# Altium project LIDO_HW_2022_04_V01.PrjPcb (part 3 of 3)

## Sheet LIDO-HW.300.DisplayInterface.SchDoc
size A3; SheetNumber: 15; SheetTotal: 17
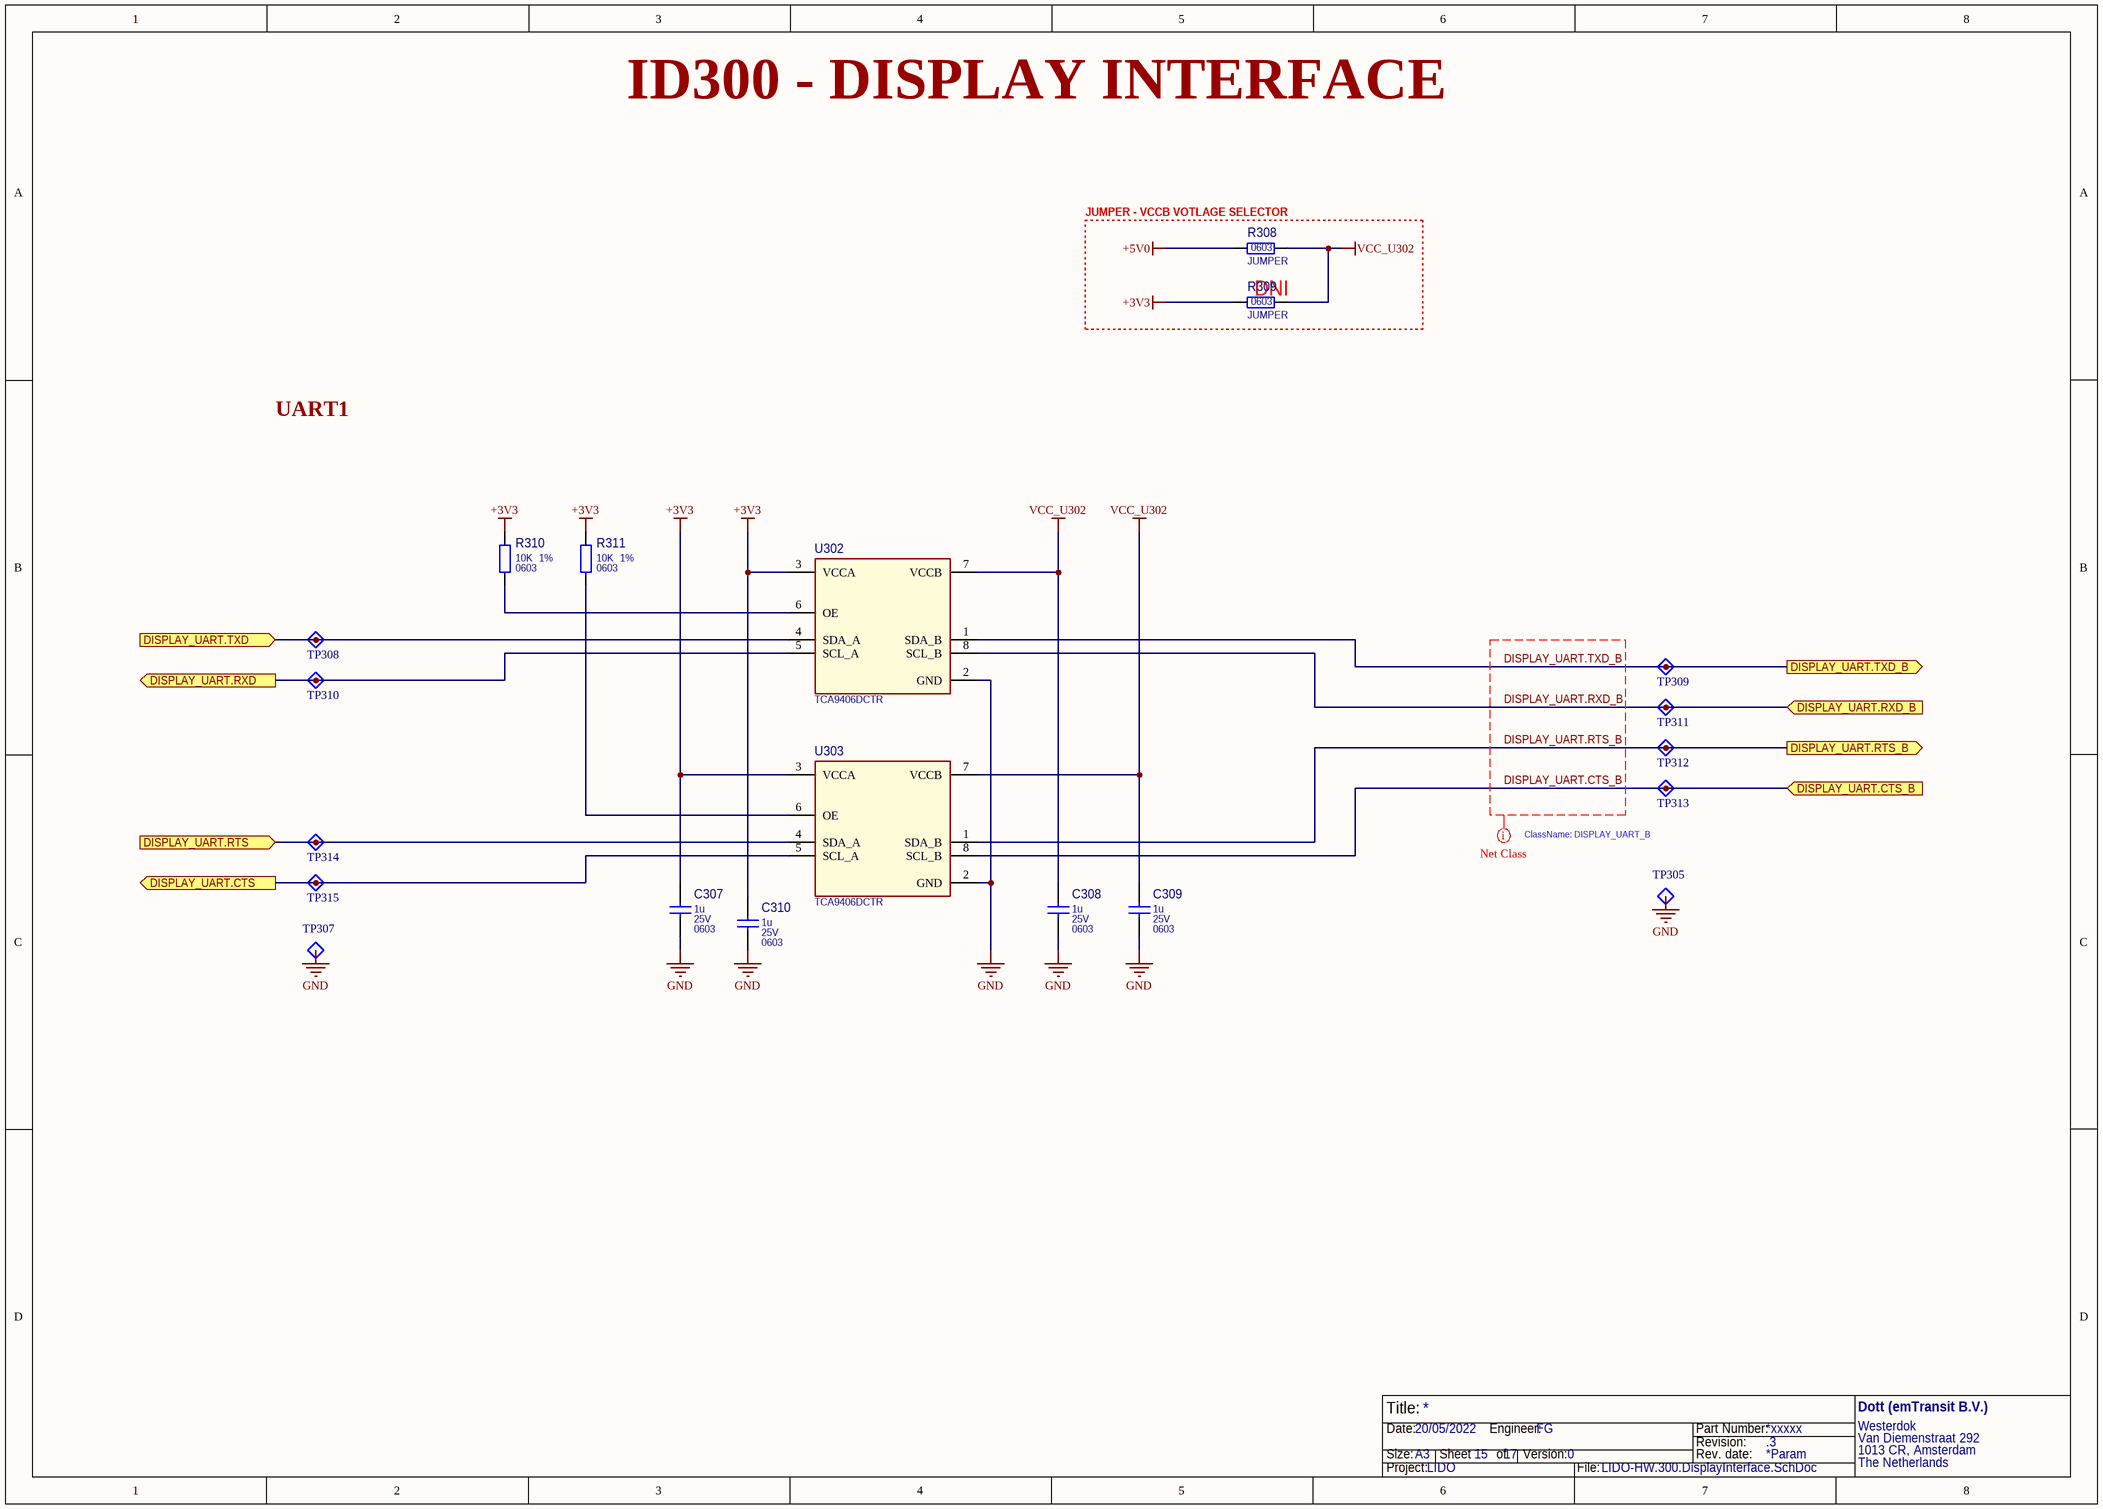
[diagram p14: LIDO-HW.300.DisplayInterface.SchDoc]

### Parts
C307  1u  Part Value 2: 25V  Part Package: 0603  [CAP_0603_1608X90-N_MURATA_A]
C308  1u  Part Value 2: 25V  Part Package: 0603  [CAP_0603_1608X90-N_MURATA_A]
C309  1u  Part Value 2: 25V  Part Package: 0603  [CAP_0603_1608X90-N_MURATA_A]
C310  1u  Part Value 2: 25V  Part Package: 0603  [CAP_0603_1608X90-N_MURATA_A]
R308  JUMPER  Part Package: 0603  [RES_0603_1608X60-N_YAGEO_A]
R309  JUMPER  Part Package: 0603  [RES_0603_1608X60-N_YAGEO_A]
R310  10K  Part Value 2: 1%  Part Package: 0603  [RES_0603_1608X60-N_YAGEO_A]
R311  10K  Part Value 2: 1%  Part Package: 0603  [RES_0603_1608X60-N_YAGEO_A]
TP305  TestPoint_A  [TESTPOINT_1D_A]  (value not drawn)  (no BOM)
TP307  TestPoint_A  [TESTPOINT_1D_A]  (value not drawn)  (no BOM)
TP308  TestPoint_A  [TESTPOINT_1D_A]  (value not drawn)  (no BOM)
TP309  TestPoint_A  [TESTPOINT_1D_A]  (value not drawn)  (no BOM)
TP310  TestPoint_A  [TESTPOINT_1D_A]  (value not drawn)  (no BOM)
TP311  TestPoint_A  [TESTPOINT_1D_A]  (value not drawn)  (no BOM)
TP312  TestPoint_A  [TESTPOINT_1D_A]  (value not drawn)  (no BOM)
TP313  TestPoint_A  [TESTPOINT_1D_A]  (value not drawn)  (no BOM)
TP314  TestPoint_A  [TESTPOINT_1D_A]  (value not drawn)  (no BOM)
TP315  TestPoint_A  [TESTPOINT_1D_A]  (value not drawn)  (no BOM)
U302  TCA9406DCTR  [SSOP8P65_295X400X130L40X25-N_TI_A]
U303  TCA9406DCTR  [SSOP8P65_295X400X130L40X25-N_TI_A]

### Blocks framed on the sheet
JUMPER - VCCB VOTLAGE SELECTOR: R308 R309

### Ports
DISPLAY_UART.CTS (out), DISPLAY_UART.CTS_B (in), DISPLAY_UART.RTS (in), DISPLAY_UART.RTS_B (out), DISPLAY_UART.RXD (out), DISPLAY_UART.RXD_B (in), DISPLAY_UART.TXD (in), DISPLAY_UART.TXD_B (out)

### Nets
+3V3: C307.1 C310.1 R309.1 R310.2 R311.2 U302.3(VCCA) U303.3(VCCA)
+5V0: R308.1
GND: C307.2 C308.2 C309.2 C310.2 TP305.1(TP) TP307.1(TP) U302.2(GND) U303.2(GND)
VCC_U302: C308.1 C309.1 R308.2 R309.2 U302.7(VCCB) U303.7(VCCB)
DISPLAY_UART.CTS: TP315.1(TP) U303.5(SCL_A) ; port DISPLAY_UART.CTS
DISPLAY_UART.CTS_B: TP313.1(TP) U303.8(SCL_B) ; port DISPLAY_UART.CTS_B
DISPLAY_UART.RTS: TP314.1(TP) U303.4(SDA_A) ; port DISPLAY_UART.RTS
DISPLAY_UART.RTS_B: TP312.1(TP) U303.1(SDA_B) ; port DISPLAY_UART.RTS_B
DISPLAY_UART.RXD: TP310.1(TP) U302.5(SCL_A) ; port DISPLAY_UART.RXD
DISPLAY_UART.RXD_B: TP311.1(TP) U302.8(SCL_B) ; port DISPLAY_UART.RXD_B
DISPLAY_UART.TXD: TP308.1(TP) U302.4(SDA_A) ; port DISPLAY_UART.TXD
DISPLAY_UART.TXD_B: TP309.1(TP) U302.1(SDA_B) ; port DISPLAY_UART.TXD_B
NetR310_1: R310.1 U302.6(OE)
NetR311_1: R311.1 U303.6(OE)

### Layout directives
net class DISPLAY_UART_B: DISPLAY_UART.CTS_B, DISPLAY_UART.RTS_B, DISPLAY_UART.RXD_B, DISPLAY_UART.TXD_B

### Notes on the sheet
- ID300 - DISPLAY INTERFACE
- UART1
- ClassName: DISPLAY_UART_B
- Title:
- Size:
- Date:
- A3
- Sheet       of
- Engineer:
- Version:
- Part Number:
- Revision:
- Rev. date:
- Project:
- File:

### Library data of the parts
C307-C310 = 78: as C154 on sheet LIDO-HW.100.InputStage_2; Part Value: 1u; Part Value 3: X7R; Package Type: SMT
R308 R309 = 9: as R138 on sheet LIDO-HW.100.InputStage_2; Part Value: JUMPER; Part Value 2: 5%; Part Value 3: 1/10W; Package Type: SMT
R310 R311 = 115: as R132-R134 on sheet LIDO-HW.100.InputStage_2; Part Value: 10K; Part Value 3: 1/10W; Package Type: SMT
TP305 TP307-TP315 = 3: as TP113-TP119 on sheet LIDO-HW.100.InputStage_2; 02_Layer: *; 01_Diameter: 1mm
U302 U303 = 6: as U103 on sheet LIDO-HW.100.InputStage_2; Manufacturer Part Number: TCA9406DCTR; Part Type: Level Translator; Part Value: TCA9406DCTR; Package Type: SMT

## Sheet LIDO-HW.300.StatusLightInterface.SchDoc
size A3; SheetNumber: 16; SheetTotal: 17
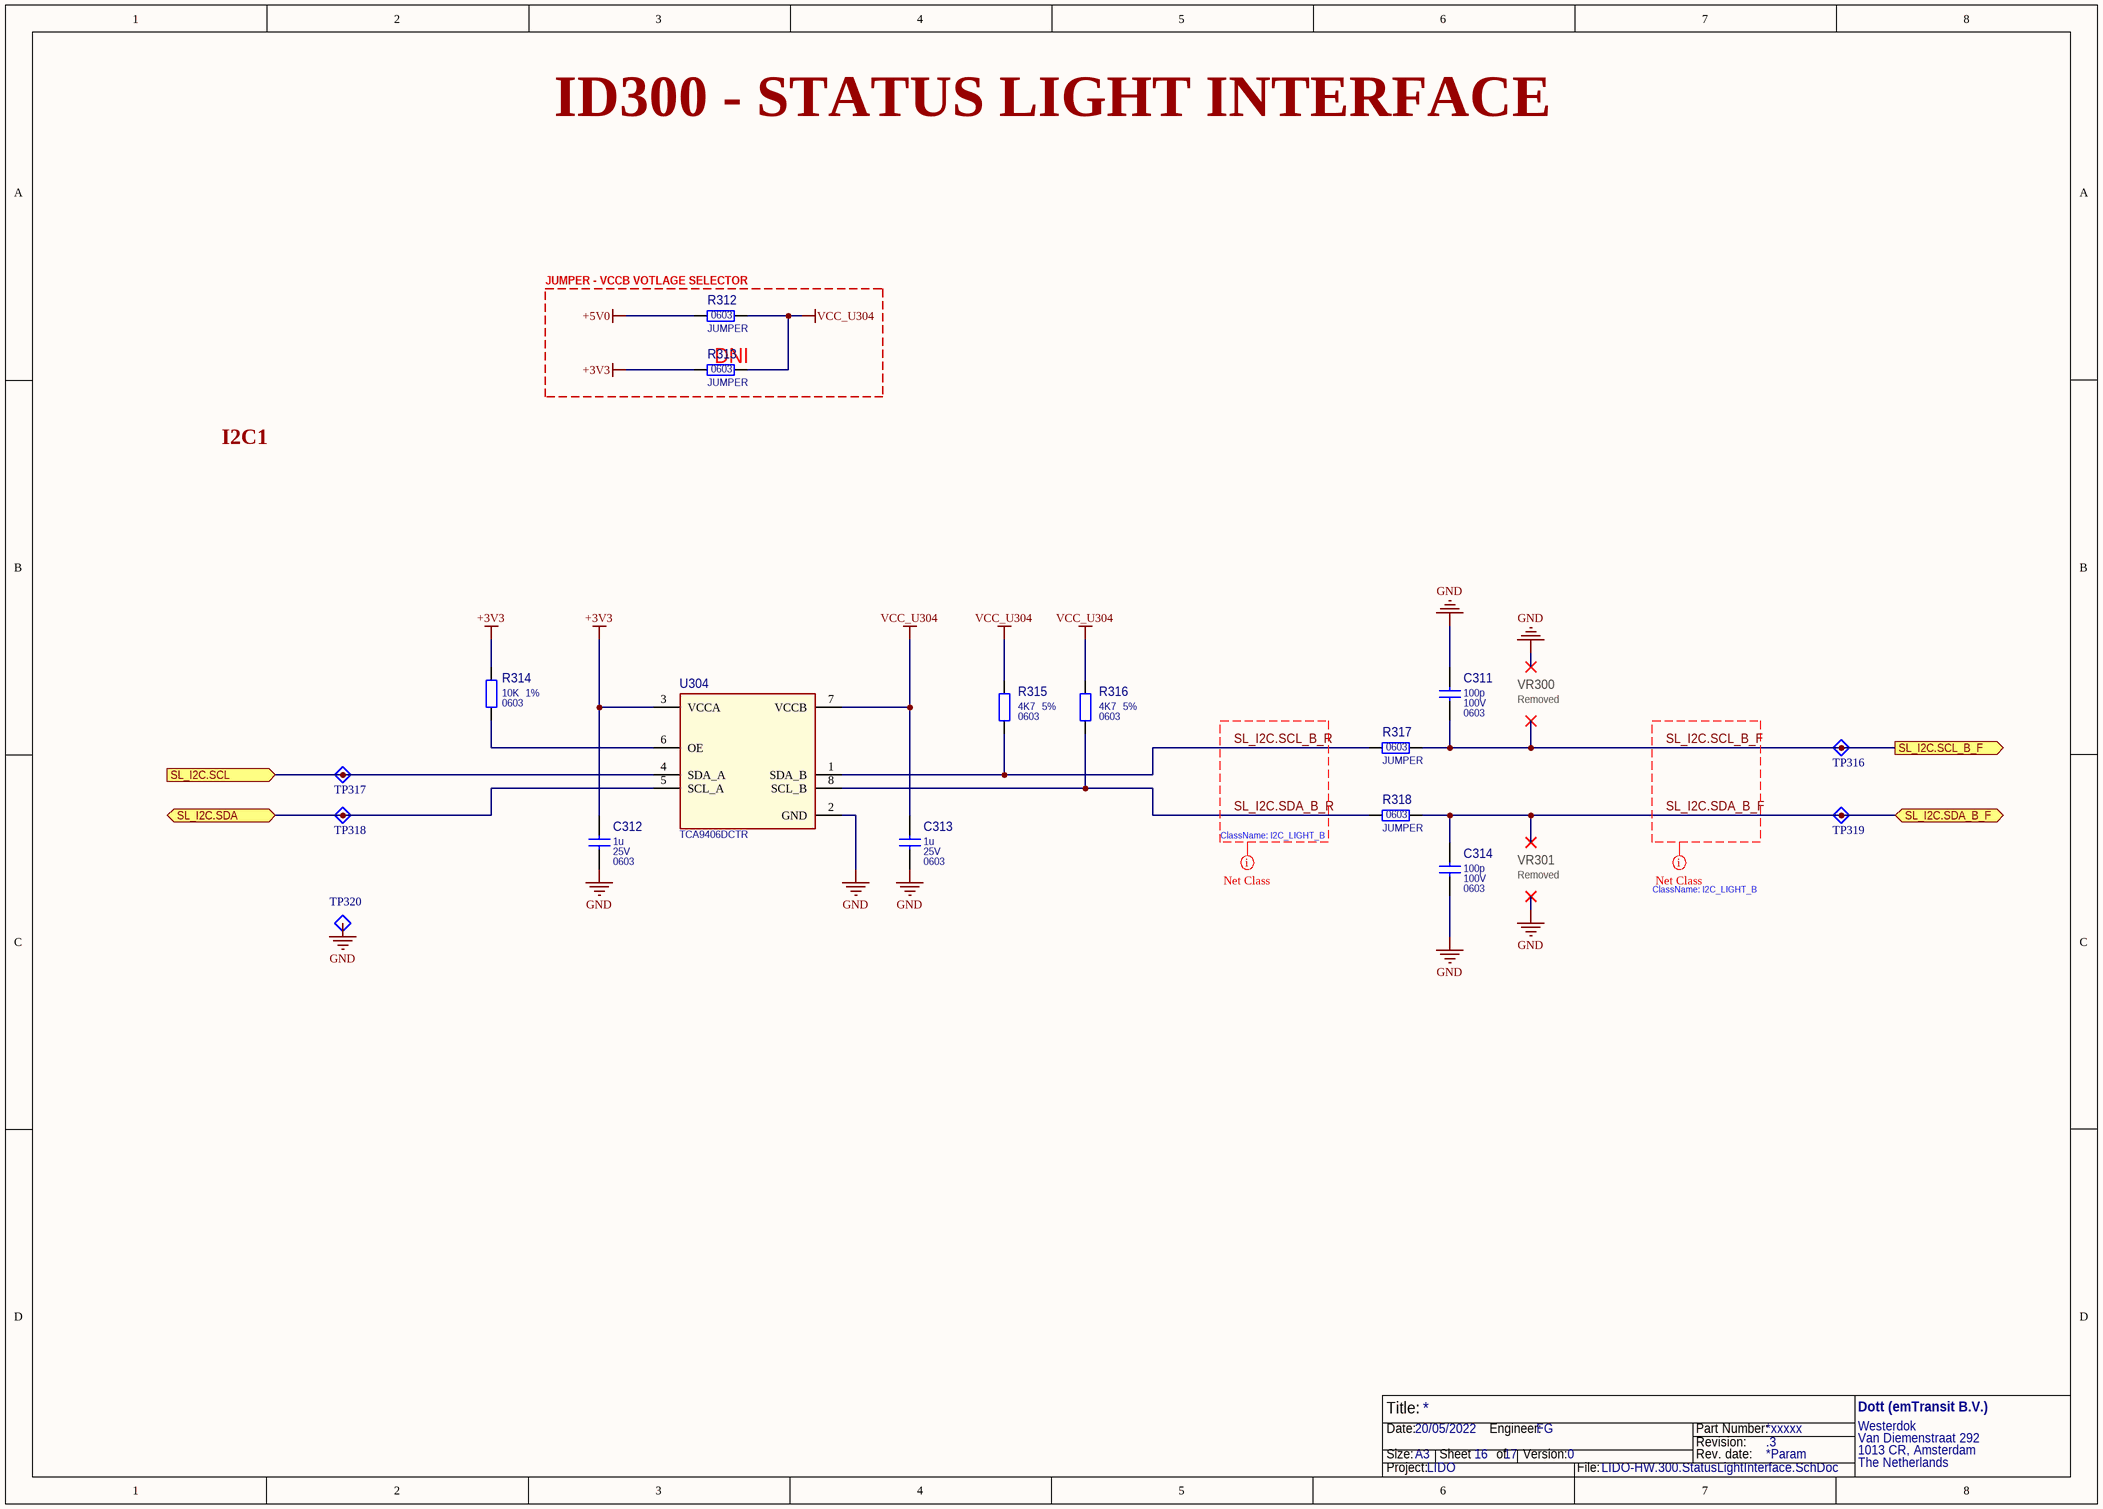
[diagram p15: LIDO-HW.300.StatusLightInterface.SchDoc]

### Parts
C311  100p  Part Value 2: 100V  Part Package: 0603  [CAP_0603_1608X90-N_MURATA_A]
C312  1u  Part Value 2: 25V  Part Package: 0603  [CAP_0603_1608X90-N_MURATA_A]
C313  1u  Part Value 2: 25V  Part Package: 0603  [CAP_0603_1608X90-N_MURATA_A]
C314  100p  Part Value 2: 100V  Part Package: 0603  [CAP_0603_1608X90-N_MURATA_A]
R312  JUMPER  Part Package: 0603  [RES_0603_1608X60-N_YAGEO_A]
R313  JUMPER  Part Package: 0603  [RES_0603_1608X60-N_YAGEO_A]
R314  10K  Part Value 2: 1%  Part Package: 0603  [RES_0603_1608X60-N_YAGEO_A]
R315  4K7  Part Value 2: 5%  Part Package: 0603  [RES_0603_1608X60-N_YAGEO_A]
R316  4K7  Part Value 2: 5%  Part Package: 0603  [RES_0603_1608X60-N_YAGEO_A]
R317  JUMPER  Part Package: 0603  [RES_0603_1608X60-N_YAGEO_A]
R318  JUMPER  Part Package: 0603  [RES_0603_1608X60-N_YAGEO_A]
TP316  TestPoint_A  [TESTPOINT_1D_A]  (value not drawn)  (no BOM)
TP317  TestPoint_A  [TESTPOINT_1D_A]  (value not drawn)  (no BOM)
TP318  TestPoint_A  [TESTPOINT_1D_A]  (value not drawn)  (no BOM)
TP319  TestPoint_A  [TESTPOINT_1D_A]  (value not drawn)  (no BOM)
TP320  TestPoint_A  [TESTPOINT_1D_A]  (value not drawn)  (no BOM)
U304  TCA9406DCTR  [SSOP8P65_295X400X130L40X25-N_TI_A]

### Blocks framed on the sheet
JUMPER - VCCB VOTLAGE SELECTOR: R312 R313

### Ports
SL_I2C.SCL (in), SL_I2C.SCL_B_F (out), SL_I2C.SDA (bidir), SL_I2C.SDA_B_F (bidir)

### Nets
+3V3: C312.1 R313.1 R314.2 U304.3(VCCA)
+5V0: R312.1
GND: C311.1 C312.2 C313.2 C314.2 TP320.1(TP) U304.2(GND)
VCC_U304: C313.1 R312.2 R313.2 R315.2 R316.2 U304.7(VCCB)
SL_I2C.SCL: TP317.1(TP) U304.4(SDA_A) ; port SL_I2C.SCL
SL_I2C.SCL_B_F: C311.2 R317.2 TP316.1(TP) ; port SL_I2C.SCL_B_F
SL_I2C.SCL_B_R: R315.1 R317.1 U304.1(SDA_B)
SL_I2C.SDA: TP318.1(TP) U304.5(SCL_A) ; port SL_I2C.SDA
SL_I2C.SDA_B_F: C314.1 R318.2 TP319.1(TP) ; port SL_I2C.SDA_B_F
SL_I2C.SDA_B_R: R316.1 R318.1 U304.8(SCL_B)
NetR314_1: R314.1 U304.6(OE)

### Layout directives
net class I2C1_LIGHT_B: SL_I2C.SCL_B_F, SL_I2C.SCL_B_R, SL_I2C.SDA_B_F, SL_I2C.SDA_B_R

### Notes on the sheet
- ID300 - STATUS LIGHT INTERFACE
- I2C1
- Removed
- VR300
- ClassName: I2C_LIGHT_B
- VR301
- Title:
- Size:
- Date:
- A3
- Sheet       of
- Engineer:
- Version:
- Part Number:
- Revision:
- Rev. date:
- Project:
- File:

### Library data of the parts
C311 C314 = 75: as C302-C304 on sheet LIDO-HW.300.VehicleInterface; Part Value: 100p; Part Value 3: 5%; Package Type: SMT
C312 C313 = 78: as C154 on sheet LIDO-HW.100.InputStage_2; Part Value: 1u; Part Value 3: X7R; Package Type: SMT
R312 R313 R317 R318 = 9: as R138 on sheet LIDO-HW.100.InputStage_2; Part Value: JUMPER; Part Value 2: 5%; Part Value 3: 1/10W; Package Type: SMT
R314 = 115: as R132-R134 on sheet LIDO-HW.100.InputStage_2; Part Value: 10K; Part Value 3: 1/10W; Package Type: SMT
R315 R316 = 119: RES 4.7K OHM 5% 1/10W 0603; Manufacturer Part Number: RC0603JR-074K7L; Manufacturer: YAGEO; Obsolete Part: False; Component ID: 119; Part Value: 4K7; Part Value 3: 1/10W; Package Type: SMT
TP316-TP320 = 3: as TP113-TP119 on sheet LIDO-HW.100.InputStage_2; 02_Layer: *; 01_Diameter: 1mm
U304 = 6: as U103 on sheet LIDO-HW.100.InputStage_2; Manufacturer Part Number: TCA9406DCTR; Part Type: Level Translator; Part Value: TCA9406DCTR; Package Type: SMT

## Sheet LIDO-HW.400.AccessoryInterfaces.SchDoc
size A3; SheetNumber: 17; SheetTotal: 17
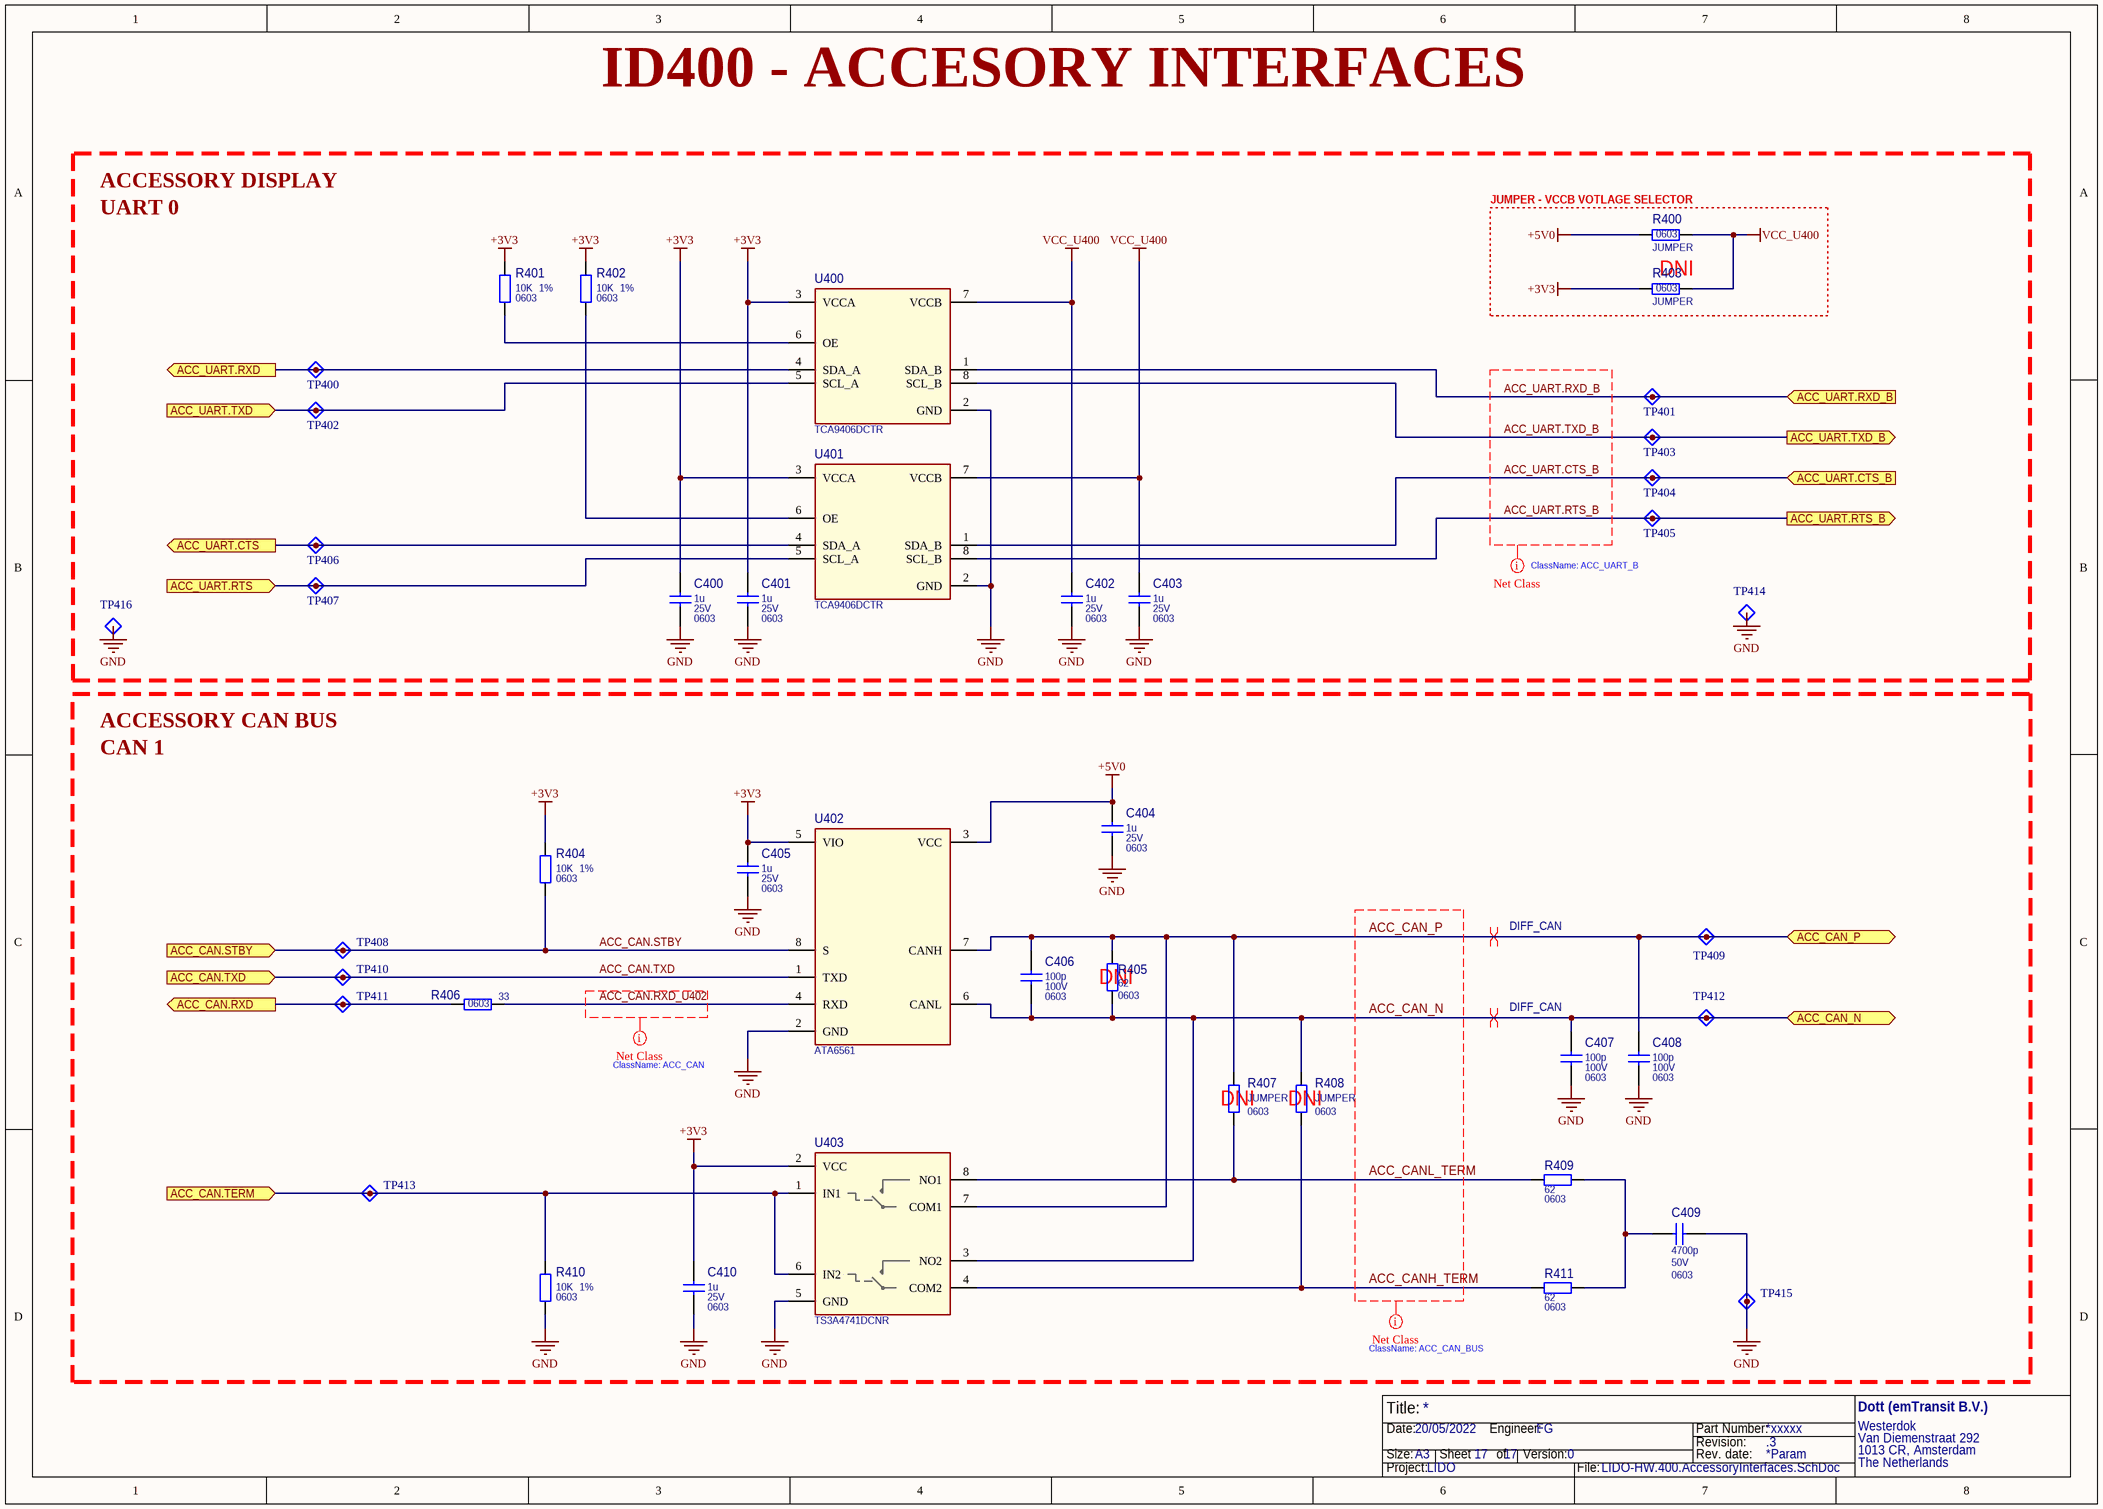
[diagram p16: LIDO-HW.400.AccessoryInterfaces.SchDoc]

### Parts
C400  1u  Part Value 2: 25V  Part Package: 0603  [CAP_0603_1608X90-N_MURATA_A]
C401  1u  Part Value 2: 25V  Part Package: 0603  [CAP_0603_1608X90-N_MURATA_A]
C402  1u  Part Value 2: 25V  Part Package: 0603  [CAP_0603_1608X90-N_MURATA_A]
C403  1u  Part Value 2: 25V  Part Package: 0603  [CAP_0603_1608X90-N_MURATA_A]
C404  1u  Part Value 2: 25V  Part Package: 0603  [CAP_0603_1608X90-N_MURATA_A]
C405  1u  Part Value 2: 25V  Part Package: 0603  [CAP_0603_1608X90-N_MURATA_A]
C406  100p  Part Value 2: 100V  Part Package: 0603  [CAP_0603_1608X90-N_MURATA_A]
C407  100p  Part Value 2: 100V  Part Package: 0603  [CAP_0603_1608X90-N_MURATA_A]
C408  100p  Part Value 2: 100V  Part Package: 0603  [CAP_0603_1608X90-N_MURATA_A]
C409  4700p  Part Value 2: 50V  Part Package: 0603  [CAP_0603_1608X90-N_MURATA_A]
C410  1u  Part Value 2: 25V  Part Package: 0603  [CAP_0603_1608X90-N_MURATA_A]
R400  JUMPER  Part Package: 0603  [RES_0603_1608X60-N_YAGEO_A]
R401  10K  Part Value 2: 1%  Part Package: 0603  [RES_0603_1608X60-N_YAGEO_A]
R402  10K  Part Value 2: 1%  Part Package: 0603  [RES_0603_1608X60-N_YAGEO_A]
R403  JUMPER  Part Package: 0603  [RES_0603_1608X60-N_YAGEO_A]
R404  10K  Part Value 2: 1%  Part Package: 0603  [RES_0603_1608X60-N_YAGEO_A]
R405  62  Part Package: 0603  [RES_0603_1608X60-N_YAGEO_A]
R406  33  Part Package: 0603  [RES_0603_1608X60-N_YAGEO_A]
R407  JUMPER  Part Package: 0603  [RES_0603_1608X60-N_YAGEO_A]
R408  JUMPER  Part Package: 0603  [RES_0603_1608X60-N_YAGEO_A]
R409  62  Part Package: 0603  [RES_0603_1608X60-N_YAGEO_A]
R410  10K  Part Value 2: 1%  Part Package: 0603  [RES_0603_1608X60-N_YAGEO_A]
R411  62  Part Package: 0603  [RES_0603_1608X60-N_YAGEO_A]
TP400  TestPoint_A  [TESTPOINT_1D_A]  (value not drawn)  (no BOM)
TP401  TestPoint_A  [TESTPOINT_1D_A]  (value not drawn)  (no BOM)
TP402  TestPoint_A  [TESTPOINT_1D_A]  (value not drawn)  (no BOM)
TP403  TestPoint_A  [TESTPOINT_1D_A]  (value not drawn)  (no BOM)
TP404  TestPoint_A  [TESTPOINT_1D_A]  (value not drawn)  (no BOM)
TP405  TestPoint_A  [TESTPOINT_1D_A]  (value not drawn)  (no BOM)
TP406  TestPoint_A  [TESTPOINT_1D_A]  (value not drawn)  (no BOM)
TP407  TestPoint_A  [TESTPOINT_1D_A]  (value not drawn)  (no BOM)
TP408  TestPoint_A  [TESTPOINT_1D_A]  (value not drawn)  (no BOM)
TP409  TestPoint_A  [TESTPOINT_1D_A]  (value not drawn)  (no BOM)
TP410  TestPoint_A  [TESTPOINT_1D_A]  (value not drawn)  (no BOM)
TP411  TestPoint_A  [TESTPOINT_1D_A]  (value not drawn)  (no BOM)
TP412  TestPoint_A  [TESTPOINT_1D_A]  (value not drawn)  (no BOM)
TP413  TestPoint_A  [TESTPOINT_1D_A]  (value not drawn)  (no BOM)
TP414  TestPoint_A  [TESTPOINT_1D_A]  (value not drawn)  (no BOM)
TP415  TestPoint_A  [TESTPOINT_1D_A]  (value not drawn)  (no BOM)
TP416  TestPoint_A  [TESTPOINT_1D_A]  (value not drawn)  (no BOM)
U400  TCA9406DCTR  [SSOP8P65_295X400X130L40X25-N_TI_A]
U401  TCA9406DCTR  [SSOP8P65_295X400X130L40X25-N_TI_A]
U402  ATA6561  [SOIC8P127_490X600X175L84X41-N_TI_A]
U403  TS3A4741DCNR  [SOT23-8P65_280X145L45-N_TI_A]

### Blocks framed on the sheet
JUMPER - VCCB VOTLAGE SELECTOR: R400 R403

### Ports
ACC_CAN.RXD (out), ACC_CAN.STBY (in), ACC_CAN.TERM (in), ACC_CAN.TXD (in), ACC_CAN_N (bidir), ACC_CAN_P (bidir), ACC_UART.CTS (out), ACC_UART.CTS_B (in), ACC_UART.RTS (in), ACC_UART.RTS_B (out), ACC_UART.RXD (out), ACC_UART.RXD_B (in), ACC_UART.TXD (in), ACC_UART.TXD_B (out)

### Nets
+3V3: C400.1 C401.1 C405.1 C410.1 R401.2 R402.2 R403.1 R404.2 U400.3(VCCA) U401.3(VCCA) U402.5(VIO) U403.2(VCC)
+5V0: C404.1 R400.1 U402.3(VCC)
GND: C400.2 C401.2 C402.2 C403.2 C404.2 C405.2 C407.2 C408.2 C409.2 C410.2 R410.1 TP414.1(TP) TP415.1(TP) TP416.1(TP) U400.2(GND) U401.2(GND) U402.2(GND) U403.5(GND)
VCC_U400: C402.1 C403.1 R400.2 R403.2 U400.7(VCCB) U401.7(VCCB)
ACC_CAN.RXD: R406.1 TP411.1(TP) ; port ACC_CAN.RXD
ACC_CAN.RXD_U402: R406.2 U402.4(RXD)
ACC_CAN.STBY: R404.1 TP408.1(TP) U402.8(S) ; port ACC_CAN.STBY
ACC_CAN.TERM: R410.2 TP413.1(TP) U403.1(IN1) U403.6(IN2) ; port ACC_CAN.TERM
ACC_CAN.TXD: TP410.1(TP) U402.1(TXD) ; port ACC_CAN.TXD
ACC_CAN_N: C406.2 C407.1 R405.1 R408.2 TP412.1(TP) U402.6(CANL) U403.3(NO2) ; port ACC_CAN_N
ACC_CAN_P: C406.1 C408.1 R405.2 R407.2 TP409.1(TP) U402.7(CANH) U403.7(COM1) ; port ACC_CAN_P
ACC_CANH_TERM: R408.1 R411.1 U403.4(COM2)
ACC_CANL_TERM: R407.1 R409.1 U403.8(NO1)
ACC_UART.CTS: TP406.1(TP) U401.4(SDA_A) ; port ACC_UART.CTS
ACC_UART.CTS_B: TP404.1(TP) U401.1(SDA_B) ; port ACC_UART.CTS_B
ACC_UART.RTS: TP407.1(TP) U401.5(SCL_A) ; port ACC_UART.RTS
ACC_UART.RTS_B: TP405.1(TP) U401.8(SCL_B) ; port ACC_UART.RTS_B
ACC_UART.RXD: TP400.1(TP) U400.4(SDA_A) ; port ACC_UART.RXD
ACC_UART.RXD_B: TP401.1(TP) U400.1(SDA_B) ; port ACC_UART.RXD_B
ACC_UART.TXD: TP402.1(TP) U400.5(SCL_A) ; port ACC_UART.TXD
ACC_UART.TXD_B: TP403.1(TP) U400.8(SCL_B) ; port ACC_UART.TXD_B
NetC409_1: C409.1 R409.2 R411.2
NetR401_1: R401.1 U400.6(OE)
NetR402_1: R402.1 U401.6(OE)

### Layout directives
net class ACC_CAN_BUS: ACC_CAN_N, ACC_CAN_P, ACC_CANH_TERM, ACC_CANL_TERM
differential pair; differential pair class DIFF_CAN: ACC_CAN_N, ACC_CAN_P
net class ACC_UART_B: ACC_UART.CTS_B, ACC_UART.RTS_B, ACC_UART.RXD_B, ACC_UART.TXD_B
net class ACC_CAN: ACC_CAN.RXD_U402

### Notes on the sheet
- ID400 - ACCESORY INTERFACES
- ACCESSORY DISPLAY
- UART 0
- (near TP405) ClassName: ACC_UART_B
- ACCESSORY CAN BUS
- CAN 1
- ClassName: ACC_CAN
- ClassName: ACC_CAN_BUS
- Title:
- Size:
- Date:
- A3
- Sheet       of
- Engineer:
- Version:
- Part Number:
- Revision:
- Rev. date:
- Project:
- File:

### Library data of the parts
C400-C405 C410 = 78: CAP CER 1UF 25V X7R 0603; Manufacturer Part Number: CGA3E1X7R1E105M080AE; Manufacturer: TDK Corporation; Obsolete Part: False; Component ID: 78; Part Value: 1u; Part Value 3: X7R; Package Type: SMT
C406-C408 = 75: CAP CER 100PF 100V C0G 0603; Manufacturer Part Number: CGA3E2C0G2A101J080AA; Manufacturer: TDK Corporation; Obsolete Part: False; Component ID: 75; Part Value: 100p; Part Value 3: 5%; Package Type: SMT
C409 = 85: CAP CER 4700PF 50V X7R 0603; Manufacturer Part Number: CGA3E2X7R1H472K080AA; Manufacturer: TDK Corporation; Obsolete Part: False; Component ID: 85; Part Value: 4700p; Part Value 3: X7R; Package Type: SMT
R400 R403 R407 R408 = 9: RES 0 OHM JUMPER 1/10W 0603; Manufacturer Part Number: RC0603JR-070RL; Manufacturer: YAGEO; Manufacturer Part Number 2nd: RMCF0603ZT0R00; Manufacturer 2nd: Stackpole Electronics Inc; Obsolete Part: False; Component ID: 9; Part Value: JUMPER; Part Value 2: 5%; Part Value 3: 1/10W; Package Type: SMT
R401 R402 R404 R410 = 115: RES 10K OHM 1% 1/10W 0603; Manufacturer Part Number: RC0603FR-0710KL; Manufacturer: YAGEO; Obsolete Part: False; Component ID: 115; Part Value: 10K; Part Value 3: 1/10W; Package Type: SMT
R405 R409 R411 = 116: RES SMD 62 OHM 1% 1/10W 0603; Manufacturer Part Number: ERJ-3EKF62R0V; Manufacturer: Panasonic Electronic Components; Obsolete Part: False; Component ID: 116; Part Value: 62; Part Value 2: 1%; Part Value 3: 1/10W; Package Type: SMT
R406 = 121: RES 33 OHM 5% 1/10W 0603; Manufacturer Part Number: RC0603JR-0733RL; Manufacturer: YAGEO; Obsolete Part: False; Component ID: 121; Part Value: 33; Part Value 2: 5%; Part Value 3: 1/10W; Package Type: SMT
TP400-TP416 = 3: Pad Diamater 1mm; Part: Test Point 1D A; Obsolete Part: False; 00_Name: TP_XXmm; Component ID: 3; 02_Layer: *; 01_Diameter: 1mm
U400 U401 = 6: Voltage Level Translator Bidirectional 1 Circuit 2 Channel 24Mbps SM8; Manufacturer: Texas Instruments; Part Package: MSOP-8; Obsolete Part: False; Component ID: 6; Manufacturer Part Number: TCA9406DCTR; Part Type: Level Translator; Part Value: TCA9406DCTR; Package Type: SMT
U402 = 4: IC TRANSCEIVER 1/1 8SO; Manufacturer: Microchip Technology; Manufacturer Part Number: ATA6561-GAQW; Part Package: SOIC-8; Obsolete Part: False; Designer: Matt Drazenovich; Ratings: RoHS; Reviewed: Dekimo_07-07-2020; Component ID: 4; Case/Package: 8-SOIC; ComponentType: IC; Design Date: 22-11-2019; Max Operating Temperature: 150°C; Min Operating Temperature: -40°C; Value: ATA6561; Part Type: TRANSCEIVER; Package Type: SMT
U403 = 5: IC SWITCH DUAL SPST SOT23-8; Manufacturer: Texas Instruments; Obsolete Part: False; Designer: Matt Drazenovich; Ratings: RoHS; Reviewed: Not Footprint; Component ID: 5; Case/Package: SOT-23-8; ComponentType: IC; Design Date: 09-09-2021; Manufacturer Part Number: TS3A4741DCNR; Max Operating Temperature: 85°C; Min Operating Temperature: -40°C; Value: TS3A4741DCNR; Part Type: ANALOG SWITCH; Part Package: SOT23-8; Package Type: SMT

## Nets that join several sheets
+3V3: LIDO-HW.100.VinAndPower (R114.2 R115.2 R119.2 TP108.1), LIDO-HW.100.InputStage_1 (D131.C D133.C D135.C D137.C), LIDO-HW.100.InputStage_2 (7 pins), LIDO-HW.100.OutputStage (C168.1 R164.2 R165.2 U104.28), LIDO-HW.200.MCU_Peripherals_1 (R200.2 R201.2 R205.2 R206.2), LIDO-HW.200.MCU_Peripherals_2 (R245.2 R246.2), LIDO-HW.200.MCU_SWD_Reset (8 pins), LIDO-HW.200.SecurityAndTemperature (6 pins), LIDO-HW.300.VehicleInterface (5 pins), LIDO-HW.300.DisplayInterface (7 pins), LIDO-HW.300.StatusLightInterface (C312.1 R313.1 R314.2 U304.3), LIDO-HW.400.AccessoryInterfaces (12 pins)
+5V0: LIDO-HW.100.VinAndPower (5 pins), LIDO-HW.100.InputStage_2 (R139.1), LIDO-HW.100.OutputStage (10 pins), LIDO-HW.300.VehicleInterface (C300.1 U300.3), LIDO-HW.300.DisplayInterface (R308.1), LIDO-HW.300.StatusLightInterface (R312.1), LIDO-HW.400.AccessoryInterfaces (C404.1 R400.1 U402.3)
+5V_SNS: LIDO-HW.100.FrontConnector (X100.9 X100.15 X100.18 X100.19), LIDO-HW.100.VinAndPower (C141.1 R116.2 TP104.1)
+12V0: LIDO-HW.100.VinAndPower (R109.2 R110.1 TP101.1), LIDO-HW.100.OutputStage (11 pins)
GND: LIDO-HW.100.FrontConnector (31 pins), LIDO-HW.100.RearConnector (42 pins), LIDO-HW.100.VinAndPower (23 pins), LIDO-HW.100.InputStage_1 (13 pins), LIDO-HW.100.InputStage_2 (15 pins), LIDO-HW.100.OutputStage (21 pins), LIDO-HW.200.MCU_Peripherals_1 (X200.3), LIDO-HW.200.MCU_Peripherals_2 (R247.1 R248.1), LIDO-HW.200.MCU_SWD_Reset (41 pins), LIDO-HW.200.SecurityAndTemperature (6 pins), LIDO-HW.300.VehicleInterface (9 pins), LIDO-HW.300.DisplayInterface (8 pins), LIDO-HW.300.StatusLightInterface (6 pins), LIDO-HW.400.AccessoryInterfaces (18 pins)
+VIN: LIDO-HW.100.RearConnector (X101.16), LIDO-HW.100.VinAndPower (F100.1)
ACC_CAN.RXD: LIDO-HW.200.MCU_Peripherals_1 (R212.1), LIDO-HW.400.AccessoryInterfaces (R406.1 TP411.1)
ACC_CAN.STBY: LIDO-HW.200.MCU_Peripherals_1 (R214.1), LIDO-HW.400.AccessoryInterfaces (R404.1 TP408.1 U402.8)
ACC_CAN.TERM: LIDO-HW.200.MCU_Peripherals_2 (R243.2), LIDO-HW.400.AccessoryInterfaces (R410.2 TP413.1 U403.1 U403.6)
ACC_CAN.TXD: LIDO-HW.200.MCU_Peripherals_1 (R210.1), LIDO-HW.400.AccessoryInterfaces (TP410.1 U402.1)
ACC_CAN_N: LIDO-HW.100.RearConnector (FB105.1), LIDO-HW.400.AccessoryInterfaces (7 pins)
ACC_CAN_P: LIDO-HW.100.RearConnector (FB104.1), LIDO-HW.400.AccessoryInterfaces (7 pins)
ACC_UART.CTS: LIDO-HW.200.MCU_Peripherals_2 (R235.1), LIDO-HW.400.AccessoryInterfaces (TP406.1 U401.4)
ACC_UART.CTS_B: LIDO-HW.100.RearConnector (R100.2), LIDO-HW.400.AccessoryInterfaces (TP404.1 U401.1)
ACC_UART.RTS: LIDO-HW.200.MCU_Peripherals_2 (R234.1), LIDO-HW.400.AccessoryInterfaces (TP407.1 U401.5)
ACC_UART.RTS_B: LIDO-HW.100.RearConnector (R101.2), LIDO-HW.400.AccessoryInterfaces (TP405.1 U401.8)
ACC_UART.RXD: LIDO-HW.200.MCU_Peripherals_2 (R233.1), LIDO-HW.400.AccessoryInterfaces (TP400.1 U400.4)
ACC_UART.RXD_B: LIDO-HW.100.RearConnector (R102.2), LIDO-HW.400.AccessoryInterfaces (TP401.1 U400.1)
ACC_UART.TXD: LIDO-HW.200.MCU_Peripherals_2 (R232.1), LIDO-HW.400.AccessoryInterfaces (TP402.1 U400.5)
ACC_UART.TXD_B: LIDO-HW.100.RearConnector (R103.2), LIDO-HW.400.AccessoryInterfaces (TP403.1 U400.8)
ACCESSORY_PWR: LIDO-HW.100.RearConnector (FB103.1), LIDO-HW.100.OutputStage (C171.1 TP124.1 U104.25)
DISPLAY_PWR: LIDO-HW.100.RearConnector (FB113.2), LIDO-HW.100.OutputStage (C170.1 TP125.1 U104.18)
DISPLAY_UART.CTS: LIDO-HW.200.MCU_Peripherals_2 (R242.2), LIDO-HW.300.DisplayInterface (TP315.1 U303.5)
DISPLAY_UART.CTS_B: LIDO-HW.100.RearConnector (R107.2), LIDO-HW.300.DisplayInterface (TP313.1 U303.8)
DISPLAY_UART.RTS: LIDO-HW.200.MCU_Peripherals_2 (R241.2), LIDO-HW.300.DisplayInterface (TP314.1 U303.4)
DISPLAY_UART.RTS_B: LIDO-HW.100.RearConnector (R106.2), LIDO-HW.300.DisplayInterface (TP312.1 U303.1)
DISPLAY_UART.RXD: LIDO-HW.200.MCU_Peripherals_1 (R223.1), LIDO-HW.300.DisplayInterface (TP310.1 U302.5)
DISPLAY_UART.RXD_B: LIDO-HW.100.RearConnector (R105.1), LIDO-HW.300.DisplayInterface (TP311.1 U302.8)
DISPLAY_UART.TXD: LIDO-HW.200.MCU_Peripherals_1 (R208.2), LIDO-HW.300.DisplayInterface (TP308.1 U302.4)
DISPLAY_UART.TXD_B: LIDO-HW.100.RearConnector (R104.1), LIDO-HW.300.DisplayInterface (TP309.1 U302.1)
DRV_SPI0.CS: LIDO-HW.100.OutputStage (R164.1 U104.3), LIDO-HW.200.MCU_Peripherals_2 (R236.2)
DRV_SPI0.MISO: LIDO-HW.100.OutputStage (R167.1), LIDO-HW.200.MCU_Peripherals_2 (R237.1)
DRV_SPI0.MOSI: LIDO-HW.100.OutputStage (U104.26), LIDO-HW.200.MCU_Peripherals_2 (R240.2)
DRV_SPI0.SCK: LIDO-HW.100.OutputStage (U104.2), LIDO-HW.200.MCU_Peripherals_2 (R239.2)
DVR.RESET: LIDO-HW.100.OutputStage (R165.1 U104.17), LIDO-HW.200.MCU_Peripherals_1 (R215.1)
FRONT_LIGHT_PWR: LIDO-HW.100.RearConnector (FB108.2), LIDO-HW.100.OutputStage (C169.1 TP126.1 U104.21)
I2C0.SCL: LIDO-HW.200.MCU_Peripherals_1 (R201.1 R211.2), LIDO-HW.200.SecurityAndTemperature (TP202.1 U202.6 U203.2)
I2C0.SDA: LIDO-HW.200.MCU_Peripherals_1 (R200.1 R213.2), LIDO-HW.200.SecurityAndTemperature (R259.1 R262.1 TP201.1)
IND_LIGHT_LEFT_PWR: LIDO-HW.100.FrontConnector (FB100.2), LIDO-HW.100.OutputStage (C165.2 TP120.1 U104.4)
IND_LIGHT_RIGHT_PWR: LIDO-HW.100.FrontConnector (FB102.2), LIDO-HW.100.OutputStage (C166.2 TP122.1 U104.8)
IND_SWITCH_CANCEL_CONN: LIDO-HW.100.FrontConnector (C101.2 D101.C X100.6), LIDO-HW.100.InputStage_2 (R137.1)
IND_SWITCH_CANCEL_F: LIDO-HW.100.InputStage_2 (C153.1 R134.1 R137.2 TP115.1), LIDO-HW.200.MCU_Peripherals_1 (R218.1)
IND_SWITCH_LEFT_CONN: LIDO-HW.100.FrontConnector (C100.2 D100.C X100.7), LIDO-HW.100.InputStage_2 (R135.1)
IND_SWITCH_LEFT_F: LIDO-HW.100.InputStage_2 (C151.1 R132.1 R135.2 TP113.1), LIDO-HW.200.MCU_Peripherals_1 (R216.1)
IND_SWITCH_RIGHT_CONN: LIDO-HW.100.FrontConnector (C102.2 D102.C X100.3), LIDO-HW.100.InputStage_2 (R136.1)
IND_SWITCH_RIGHT_F: LIDO-HW.100.InputStage_2 (C152.1 R133.1 R136.2 TP114.1), LIDO-HW.200.MCU_Peripherals_1 (R217.1)
LEFT_BRAKE_SIG: LIDO-HW.100.InputStage_1 (C150.1 R130.2 TP112.1), LIDO-HW.200.MCU_Peripherals_2 (R228.1)
LEFT_BRAKE_SIG_CONN: LIDO-HW.100.FrontConnector (C104.2 D104.C X100.10), LIDO-HW.100.InputStage_1 (R129.2)
RIGHT_BRAKE_SIG: LIDO-HW.100.InputStage_1 (C149.1 R127.2 TP111.1), LIDO-HW.200.MCU_Peripherals_2 (R244.2)
RIGHT_BRAKE_SIG_CONN: LIDO-HW.100.FrontConnector (C106.1 D107.C X100.16), LIDO-HW.100.InputStage_1 (R126.2)
SL_I2C.SCL: LIDO-HW.200.MCU_Peripherals_1 (R206.1 R219.2), LIDO-HW.300.StatusLightInterface (TP317.1 U304.4)
SL_I2C.SCL_B_F: LIDO-HW.100.RearConnector (FB106.2), LIDO-HW.300.StatusLightInterface (C311.2 R317.2 TP316.1)
SL_I2C.SDA: LIDO-HW.200.MCU_Peripherals_1 (R205.1 R221.2), LIDO-HW.300.StatusLightInterface (TP318.1 U304.5)
SL_I2C.SDA_B_F: LIDO-HW.100.RearConnector (FB109.1), LIDO-HW.300.StatusLightInterface (C314.1 R318.2 TP319.1)
SNS_OC.EN: LIDO-HW.100.VinAndPower (R115.1 TP106.1 U101.3), LIDO-HW.200.MCU_Peripherals_2 (R231.2)
SNS_OC.FLT: LIDO-HW.100.VinAndPower (R114.1 TP105.1 U101.4), LIDO-HW.200.MCU_Peripherals_2 (R238.1)
SPARE_GPIO1_CONN: LIDO-HW.100.FrontConnector (C107.2 D105.C X100.11), LIDO-HW.100.InputStage_2 (R142.2)
SPARE_GPIO1_F: LIDO-HW.100.InputStage_2 (TP117.1 U103.4), LIDO-HW.200.MCU_Peripherals_1 (R202.1)
SPARE_GPIO2_CONN: LIDO-HW.100.RearConnector (C119.1 D120.C X101.19), LIDO-HW.100.InputStage_2 (R144.2)
SPARE_GPIO2_F: LIDO-HW.100.InputStage_2 (TP119.1 U103.5), LIDO-HW.200.MCU_Peripherals_1 (R203.1)
SPARE_OUT1_PWR: LIDO-HW.100.FrontConnector (FB101.1), LIDO-HW.100.OutputStage (C173.1 Q100.3 R168.2 TP128.1)
SPARE_OUT2_PWR: LIDO-HW.100.RearConnector (FB110.1), LIDO-HW.100.OutputStage (C172.1 Q101.3 R169.2 TP130.1)
STATUS_LIGHT_PWR: LIDO-HW.100.RearConnector (FB107.1), LIDO-HW.100.OutputStage (C167.2 TP123.1 U104.22)
THROTTLE_1_SIG: LIDO-HW.100.InputStage_1 (C147.1 R121.2 TP109.1), LIDO-HW.200.MCU_Peripherals_1 (R207.1)
THROTTLE_1_SIG_CONN: LIDO-HW.100.FrontConnector (C108.1 D108.C X100.21), LIDO-HW.100.InputStage_1 (R120.2)
THROTTLE_2_SIG: LIDO-HW.100.InputStage_1 (C148.1 R124.2 TP110.1), LIDO-HW.200.MCU_Peripherals_1 (R209.1)
THROTTLE_2_SIG_CONN: LIDO-HW.100.FrontConnector (C109.1 D109.C X100.20), LIDO-HW.100.InputStage_1 (R123.2)
TMP_PWRLERT: LIDO-HW.200.MCU_Peripherals_1 (R227.1), LIDO-HW.200.SecurityAndTemperature (R260.1 TP203.1 U203.3)
VEH_CAN.RXD: LIDO-HW.200.MCU_Peripherals_1 (R224.2), LIDO-HW.300.VehicleInterface (R302.1 TP303.1)
VEH_CAN.STBY: LIDO-HW.200.MCU_Peripherals_1 (R220.1), LIDO-HW.300.VehicleInterface (R300.1 TP300.1 U300.8)
VEH_CAN.TERM: LIDO-HW.200.MCU_Peripherals_1 (R204.2), LIDO-HW.300.VehicleInterface (R307.2 TP306.1 U301.1 U301.6)
VEH_CAN.TXD: LIDO-HW.200.MCU_Peripherals_1 (R222.2), LIDO-HW.300.VehicleInterface (TP302.1 U300.1)
VEH_CAN_N: LIDO-HW.100.RearConnector (FB112.2), LIDO-HW.300.VehicleInterface (7 pins)
VEH_CAN_P: LIDO-HW.100.RearConnector (FB111.2), LIDO-HW.300.VehicleInterface (7 pins)

## Assembly variants
DEVELOPMENT: not fitted C134 C138 C140 C145 C156 C159 C160 C220 R139 R145 R146 R151 R152 R153 R154 R157 R159 R160 R162 R168 R169 R301 R303 R304 R309 R313 R403 R405 R407 R408